# Altium schematic sheet adc.SchDoc: =GlobalProjectName
size 209 x 297 mm; ApprovedBy: Утвердил; CheckedBy: Проверил; Author: Разработал; SheetNumber: 2; SheetTotal: 9; PageSetup: Record=PageOptions|CenterHorizontal=True|CenterVertical=True|PrintScale=1.00|XCorrection=1.00|YCorrection=1.00|PrintKind=1|BorderSize=5000000|LeftOffset=0|BottomOffset=0|Orientation=2|PaperLength=1000|PaperWidth=1000|Scale=100|PaperSource=15|PrintQuality=1200|MediaType=1|DitherType=10|PaperKind=A3|PrintScaleMode=1; Weight: -; ScaleFactor: -; NormInspection: Норм.Контр.
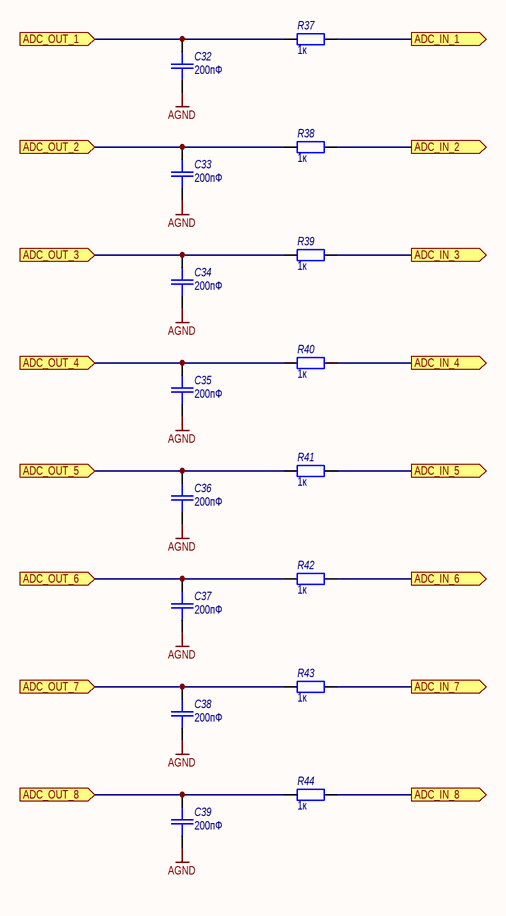
[diagram p0: adc.SchDoc]

## Parts
C32  200пФ  [SMD_0805]
C33  200пФ  [SMD_0805]
C34  200пФ  [SMD_0805]
C35  200пФ  [SMD_0805]
C36  200пФ  [SMD_0805]
C37  200пФ  [SMD_0805]
C38  200пФ  [SMD_0805]
C39  200пФ  [SMD_0805]
R37  1к  [SMD_0805]
R38  1к  [SMD_0805]
R39  1к  [SMD_0805]
R40  1к  [SMD_0805]
R41  1к  [SMD_0805]
R42  1к  [SMD_0805]
R43  1к  [SMD_0805]
R44  1к  [SMD_0805]

## Ports
ADC_IN_1 (out), ADC_IN_2 (out), ADC_IN_3 (out), ADC_IN_4 (out), ADC_IN_5 (out), ADC_IN_6 (out), ADC_IN_7 (out), ADC_IN_8 (out), ADC_OUT_1 (in), ADC_OUT_2 (in), ADC_OUT_3 (in), ADC_OUT_4 (in), ADC_OUT_5 (in), ADC_OUT_6 (in), ADC_OUT_7 (in), ADC_OUT_8 (in)

## Nets
AGND: C32.1 C33.1 C34.1 C35.1 C36.1 C37.1 C38.1 C39.1
ADC_IN_1: R37.2 ; port ADC_IN_1
ADC_IN_2: R38.2 ; port ADC_IN_2
ADC_IN_3: R39.2 ; port ADC_IN_3
ADC_IN_4: R40.2 ; port ADC_IN_4
ADC_IN_5: R41.2 ; port ADC_IN_5
ADC_IN_6: R42.2 ; port ADC_IN_6
ADC_IN_7: R43.2 ; port ADC_IN_7
ADC_IN_8: R44.2 ; port ADC_IN_8
ADC_OUT_1: C32.2 R37.1 ; port ADC_OUT_1
ADC_OUT_2: C33.2 R38.1 ; port ADC_OUT_2
ADC_OUT_3: C34.2 R39.1 ; port ADC_OUT_3
ADC_OUT_4: C35.2 R40.1 ; port ADC_OUT_4
ADC_OUT_5: C36.2 R41.1 ; port ADC_OUT_5
ADC_OUT_6: C37.2 R42.1 ; port ADC_OUT_6
ADC_OUT_7: C38.2 R43.1 ; port ADC_OUT_7
ADC_OUT_8: C39.2 R44.1 ; port ADC_OUT_8

## Notes on the sheet
- Подп. и дата
- Инв. № дубл.
- Взам. инв. №
- Инв. № подл.
- Изм.
- Лист
- № докум.
- Подп.
- Дата
- Форма 2а ГОСТ 2.104-2006
- Копировал
- Формат А4

## Library data of the parts
C32-C39 = Capacitor: Назначение: SMD-конденсатор; Наименование: Конденсатор; Потребление, Вт: 0; Value: 0,1мкФ
R37-R44 = Resistor: Наименование: Резистор; Назначение: SMD-резистор; Потребление, Вт: 0,001; Value: 1к